# Altium schematic sheet EEPROM_and_Actuator.SchDoc: Title-Name
size A4; Organization: Test-Engineering; Address1: Hans-Bunte-Strasse 19; Address2: D-79108 Freiburg; Address3: Germany; DocumentNumber: Document Nr.; SheetNumber: 1; SheetTotal: 1; Date: Date Engineer; CheckedBy: Reviewer; CompanyName: TDK-Micronas GmbH; DrawnBy: Draftsman; Engineer: Engineer; PageSetup: Record=PageOptions|CenterHorizontal=True|CenterVertical=True|PrintScale=0.97|XCorrection=1.00|YCorrection=1.00|PrintKind=0|BorderSize=5000000|LeftOffset=0|BottomOffset=0|Orientation=2|PaperLength=1000|PaperWidth=1000|Scale=100|PaperSource=7|PrintQuality=-3|MediaType=1|DitherType=10|PrintScaleMode=1|PaperKind=A4|PaperIndex=9
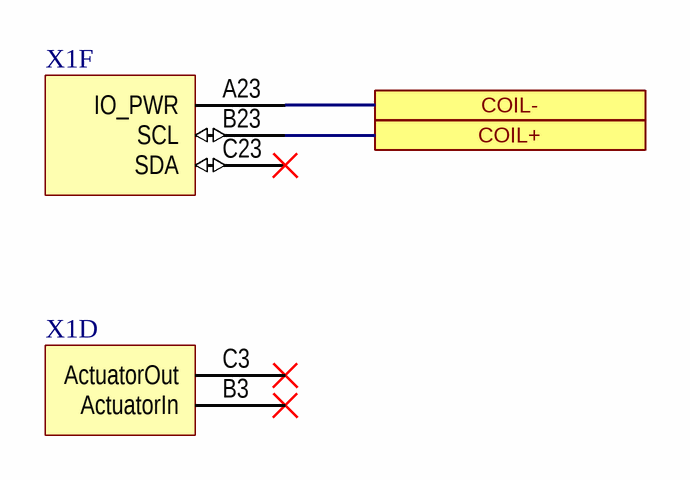
[diagram p0: EEPROM_and_Actuator.SchDoc]

## Parts
X1  09731966907  [09731966907]  (value not drawn)  (parts D,F of 8)

## Ports
COIL+ (harness VC), COIL- (harness VC)

## Nets

Not connected (* = marked no-connect by the designer): X1 A23(IO_PWR) B3(ActuatorIn)* B23(SCL) C3(ActuatorOut)* C23(SDA)*

## Notes on the sheet
- Designed by
- Reviewed by
- Drawn by
- Semi-ATE Ltd.
- Altium Rev.:
- Project:
- Variant:
- Bulgaria
- 3400, Montana
- Ivan Vazov 8, Str.
- File:
- Revision
- Sheets
- of
- A4

## Library data of the parts
X1 = MiniSCT8: 96 Position Din Connector Header, Male Pins Gold or Gold-Palladium Through Hole; Manufacturer: Harting; Manufacturer Part Number: 09731966907; ComponentLink1Description: Datasheet; ComponentLink1URL: https://b2b.harting.com/files/download/PRD/PDF_DS/09731100001_100560208DRW001D.pdf; ComponentLink2Description: Reference; ComponentLink2URL: https://www.digikey.de/products/en?keywords=09731966907; Supplier 1: Digi-Key; Supplier Part Number 1: 1195-5217-ND